# EasyEDA Pro project ProDoc_OHPP_003A_MIDI_B.epro, schematic OHPP-003A-MIDI_B_2

## Sheets
1 POWER BLOCK DIAGRAM: Board Name: OHPP-003A MIDI-B; Create Date: 2025-08-11; Page Name: POWER BLOCK DIAGRAM; Project Name: OHPP-003A-MIDI Cable Replacement; Schematic Name: OHPP-003A-MIDI_B; Update Date: 2025-09-15; Company: Silicon Labs; Page Size: A3; Version: V1.0
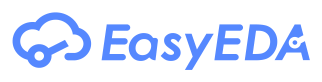
[diagram p0: POWER BLOCK DIAGRAM]
2 MIDI: Board Name: OHPP-003A MIDI-B_2; Create Date: 2025-11-18; Page Name: MIDI; Schematic Name: OHPP-003A-MIDI_B_2; Update Date: 2025-11-18
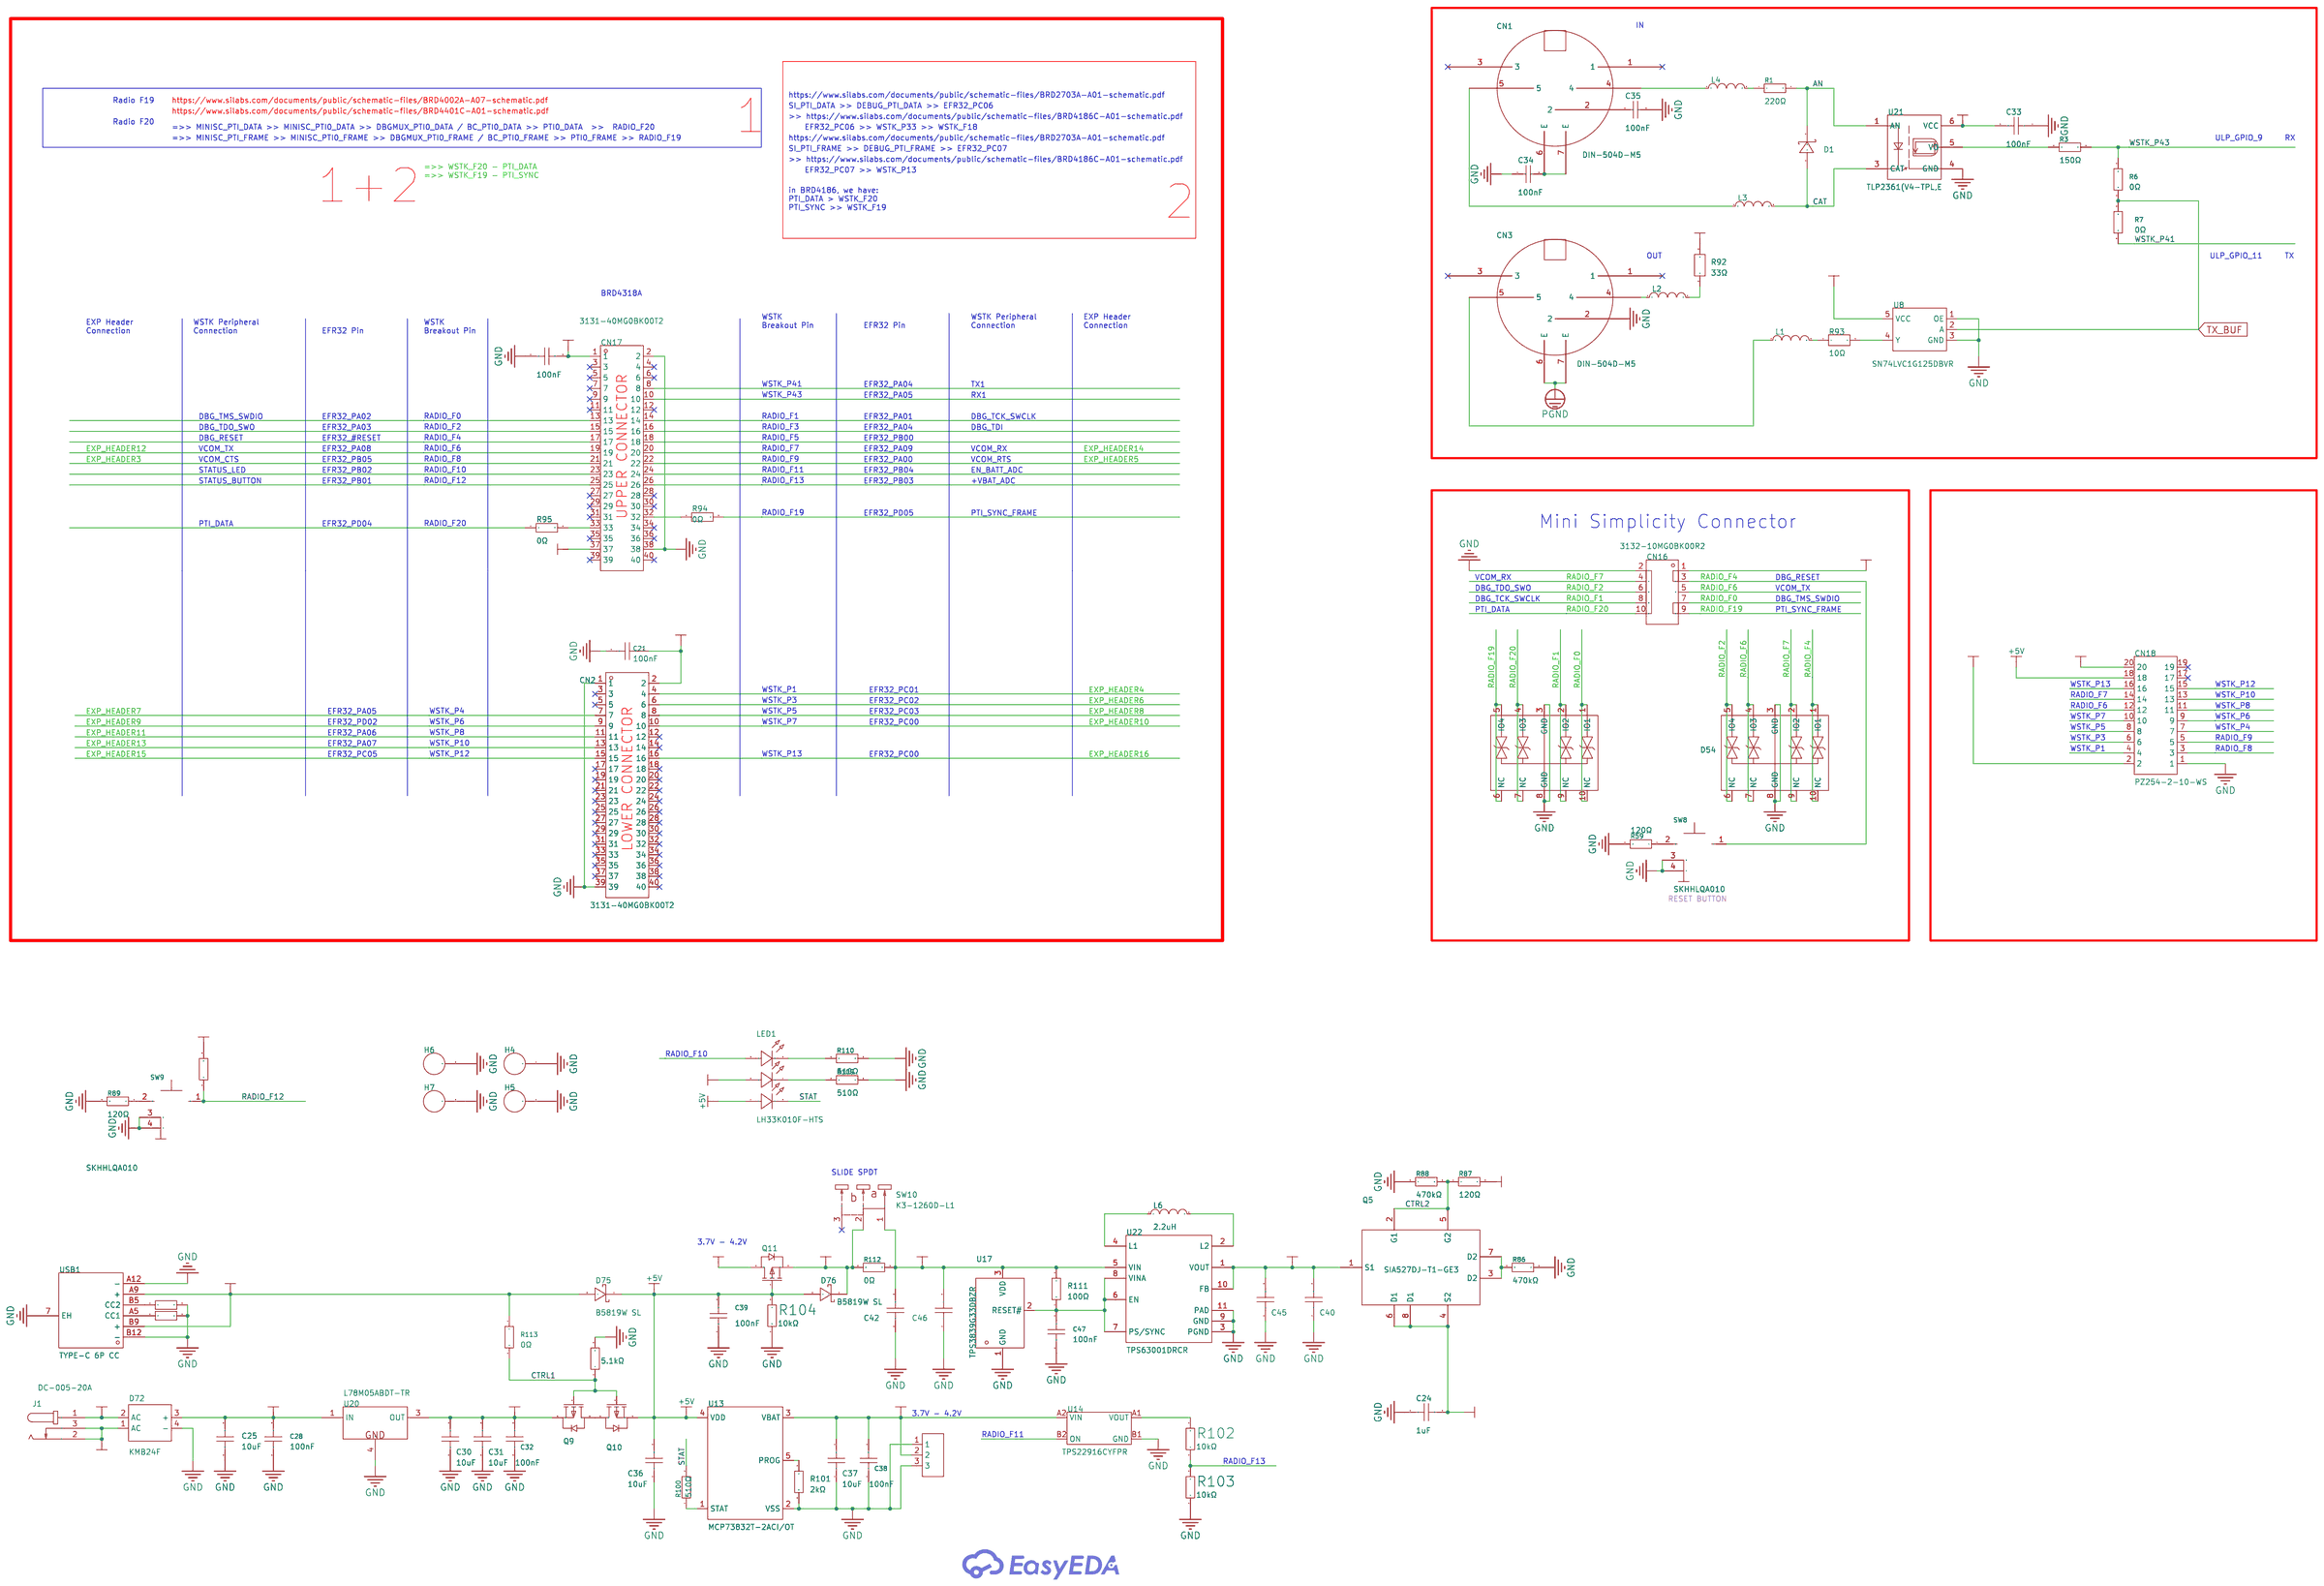
[diagram p1: MIDI]

## Parts
C20  100nF  [C0603]
C21  100nF  [C0603]
C24  1uF  [C0603]
C25  10uF  [C0603]
C28  100nF  [C0603]
C30  10uF  [C0603]
C31  10uF  [C0603]
C32  100nF  [C0603]
C33  100nF  [C0603]
C34  100nF  [C0805]
C35  100nF  [C0805]
C36  10uF  [C0603]
C37  10uF  [C0603]
C38  100nF  [C0603]
C39  100nF  [C0603]
C40  10uF  [C0603]
C42  10uF  [C0603]
C45  10uF  [C0603]
C46  10uF  [C0603]
C47  100nF  [C0603]
CN1  DIN-504D-M5  [CONN-TH_DIN-504D-M5]
CN2  3131-40MG0BK00T2  [CONN-SMD_40P-P1.27_WCON_3131-40MG0BK00T2]
CN3  DIN-504D-M5  [CONN-TH_DIN-504D-M5]
CN16  3132-10MG0BK00R2  [IDC-SMD_3132-10MG0BK00R2]
CN17  3131-40MG0BK00T2  [CONN-SMD_40P-P1.27_WCON_3131-40MG0BK00T2]
CN18  PZ254-2-10-WS  [HDR-SMD_20P-P2.54-H-M-R2-C10_L8.5]
D1  MBRA140T3G  [SMA_L4.3-W2.6-LS5.2-RD]
D54  TPD4E02B04DQAR  [USON-10_L2.5-W1.0-P0.50-BL]
D69  TPD4E02B04DQAR  [USON-10_L2.5-W1.0-P0.50-BL]
D72  KMB24F  [DIO-BG-SMD_MBF-TL]
D75  B5819W SL  [SOD-123_L2.7-W1.6-LS3.7-RD-1]
D76  B5819W SL  [SOD-123_L2.7-W1.6-LS3.7-RD-1]
H4  -  [HOLE_D3M5_D7M0_PAD_PTH]  (no BOM)
H5  -  [HOLE_D3M5_D7M0_PAD_PTH]  (no BOM)
H6  -  [HOLE_D3M5_D7M0_PAD_PTH]  (no BOM)
H7  -  [HOLE_D3M5_D7M0_PAD_PTH]  (no BOM)
H8  KH-2.54PH180-1X3P-L11.5  [HDR-TH_3P-P2.54-V-M]
J1  DC-005-20A  [DC-IN-TH_DC-005-20A]
L1  MMZ1608Y102BTD25  [L0603]
L2  MMZ1608Y102BTD25  [L0603]
L3  MMZ1608Y102BTD25  [L0603]
L4  MMZ1608Y102BTD25  [L0603]
L6  2.2uH  [L0806]
LED1  LH33K010F-HTS  [LED-TH_6P-L11.6-W4.4-P2.54_LH33K010F-HTS]
Q5  SIA527DJ-T1-GE3  [POWERPAK-SC-70-6_L2.0-W2.0-P0.65-BL]
Q9  SI2301CDS-T1-GE3  [SOT-23-3_L3.0-W1.7-P0.95-LS2.9-BR]
Q10  SI2301CDS-T1-GE3  [SOT-23-3_L3.0-W1.7-P0.95-LS2.9-BR]
Q11  SI2301CDS-T1-GE3  [SOT-23-3_L3.0-W1.7-P0.95-LS2.9-BR]
R1  220Ω  [R0603]
R3  150Ω  [R0603]
R6  0Ω  [R0402]  (no BOM)
R7  0Ω  [R0402]
R59  120Ω  [R0603]
R86  470kΩ  [R0603]  (no BOM)
R87  120Ω  [R0603]
R88  470kΩ  [R0603]
R89  120Ω  [R0603]
R91  10kΩ  [R0603]
R92  33Ω  [R0805]
R93  10Ω  [R0805]
R94  0Ω  [R0603]
R95  0Ω  [R0603]
R96  5.1kΩ  [R0603]
R97  5.1kΩ  [R0603]
R98  5.1kΩ  [R0603]
R100  510Ω  [R0603]
R101  2kΩ  [R0603]
R102  10kΩ  [R0603]
R103  10kΩ  [R0603]
R104  10kΩ  [R0603]
R109  510Ω  [R0603]
R110  510Ω  [R0603]
R111  100Ω  [R0603]
R112  0Ω  [R0402]  (no BOM)
R113  0Ω  [R0402]
SW8  SKHHLQA010  [KEY-TH_4P-SKHHLQA010]
SW9  SKHHLQA010  [KEY-TH_4P-SKHHLQA010]
SW10  K3-1260D-L1  [SW-TH_K3-1260D-L1]
U8  SN74LVC1G125DBVR  [SOT-23-5_L3.0-W1.7-P0.95-LS2.8-BL]
U13  MCP73832T-2ACI/OT  [SOT-23-5_L3.0-W1.7-P0.95-LS2.8-BR]
U14  TPS22916CYFPR  [DSBGA-4_L0.8-W0.8-R2-C2-P0.40-BL]
U17  TPS3839G33DBZR  [SOT-23-3_L2.9-W1.3-P1.90-LS2.4-BR]  (no BOM)
U20  L78M05ABDT-TR  [TO-252-2_L6.5-W6.1-P4.58-LS10.0-TL]
U21  TLP2361(V4-TPL,E  [OPTO-SMD-5_L3.7-W4.6-P1.27-LS7.0-BR]
U22  TPS63001DRCR  [VSON-10_L3.0-W3.0-P0.50-TL-EP_TPS62410DRCR]
USB1  TYPE-C 6P CC  [TYPE-C-TH_SHOUHAN_TYPE-C-6P-CC]

## Library data of the parts
C20 C21 C28 C32 C33 C38 C39 C47 = CC0603KRX7R9BB104: Capacitance: Tolerance:±10% Tolerance:±10% Voltage Rated: Temperature Coefficient:; LCSC Part Name: 100nF ±10% 50V; Supplier Part: C14663; Manufacturer: YAGEO(国巨); Supplier Footprint: 0603; JLCPCB Part Class: Basic Part; Datasheet: https://atta.szlcsc.com/upload/public/pdf/source/20180910/C282072_33301C7F631E79921B82A8DAC6BCC5B3.pdf; Supplier: LCSC; Tolerance: ±10%
C24 = CL10A105KB8NNNC: Capacitance: Tolerance:±10% Tolerance:±10% Voltage Rated: Temperature Coefficient:; LCSC Part Name: 1uF ±10% 50V; Supplier Part: C15849; Manufacturer: SAMSUNG(三星); Supplier Footprint: 0603; JLCPCB Part Class: Basic Part; Datasheet: https://atta.szlcsc.com/upload/public/pdf/source/20160218/1457707763339.pdf; Supplier: LCSC; Tolerance: ±10%
C25 C30 C31 C36 C37 C40 C42 C45 C46 = CL10A106MA8NRNC: Capacitance:10uF Tolerance:±20% Tolerance:±20% Voltage Rating:25V Temperature Coefficient:X5R; LCSC Part Name: 10uF ±20% 25V; Supplier Part: C96446; Manufacturer: SAMSUNG(三星); Supplier Footprint: 0603; JLCPCB Part Class: Basic Part; Datasheet: https://item.szlcsc.com/datasheet/CL10A106MA8NRNC/97651.html; Supplier: LCSC; Tolerance: ±20%; Voltage Rating: 25V; Temperature Coefficient: X5R
C34 C35 = CL21B104KCFNNNE: Capacitance: Tolerance:±10% Tolerance:±10% Voltage Rated: Temperature Coefficient:; LCSC Part Name: 100nF ±10% 100V; Supplier Part: C28233; Manufacturer: SAMSUNG(三星); Supplier Footprint: 0805; JLCPCB Part Class: Basic Part; Datasheet: https://atta.szlcsc.com/upload/public/pdf/source/20160218/1457707763339.pdf; Supplier: LCSC; Tolerance: ±10%
CN1 CN3 = DIN-504D-M5-CP-V1.0.0: Supplier Part: C2939347; Manufacturer: HOOYA(皓宇电子); Supplier Footprint: 插件; Datasheet: https://atta.szlcsc.com/upload/public/pdf/source/20220120/532EF17F4E31596A224288A7E1F8E76D.pdf; Supplier: LCSC
CN2 = 3131-40MG0BK00T2: Connector Type:Simple cow constellation Pitch:1.27mm Number of Positions or Pins:2x20P Current Rating:1A Voltage Rating (Max):- Holder Type:Standing paste Row Spacing:1.27mm Number of Rows:2 Number of PINs Per Row:20 Operating Temperature:-40℃~+105℃ Opera; LCSC Part Name: 1.27mm 2x20P 排数:2 每排P数:20; Supplier Part: C976753; Manufacturer: Wcon(维峰电子); Supplier Footprint: SMD,P=1.27mm; JLCPCB Part Class: Extended Part; Datasheet: https://atta.szlcsc.com/upload/public/pdf/source/20211202/B702BBAB0AED51B28E1877A6EDDD5ECD.pdf; Supplier: LCSC; Connector Type: Simple cow constellation; Pitch: 1.27mm; Number of Positions or Pins: 2x20P; Current Rating: 1A; Holder Type: Standing paste; Row Spacing: 1.27mm; Number of Rows: 2; Number of PINs Per Row: 20; Operating Temperature: -40℃~+105℃
CN16 = 3132-10MG0BK00R2: Connector Type:简牛座 Pitch:1.27mm Structure:2x5P Holder Type:Brick nogging Row Spacing:1.27mm Number of Rows:2 Pin Number in each Row:5 Contact Material:Brass Contact Plating:Gold; Supplier: LCSC; Supplier Part: C783843; Manufacturer: Wcon(维峰电子); LCSC Part Name: 1.27mm 2x5P 排数:2 每排P数:5; Supplier Footprint: SMD,P=1.27mm; Datasheet: https://atta.szlcsc.com/upload/public/pdf/source/20200914/C783843_74B4F3B0F5055CA38342214C72674E3E.pdf; Connector Type: 简牛座; Pitch: 1.27mm; Structure: 2x5P; Holder Type: Brick nogging; Row Spacing: 1.27mm; Number of Rows: 2; Pin Number in each Row: 5; Contact Material: Brass; Contact Plating: Gold
CN17 = 3131-40MG0BK00T2-UP-CP-V1.0.0: Connector Type:Simple cow constellation Pitch:1.27mm Number of Positions or Pins:2x20P Current Rating:1A Voltage Rating (Max):- Holder Type:Standing paste Row Spacing:1.27mm Number of Rows:2 Number of PINs Per Row:20 Operating Temperature:-40℃~+105℃ Opera; LCSC Part Name: 1.27mm 2x20P 排数:2 每排P数:20; Supplier Part: C976753; Manufacturer: Wcon(维峰电子); Supplier Footprint: SMD,P=1.27mm; Datasheet: https://atta.szlcsc.com/upload/public/pdf/source/20211202/B702BBAB0AED51B28E1877A6EDDD5ECD.pdf; Supplier: LCSC; Connector Type: Simple cow constellation; Pitch: 1.27mm; Number of Positions or Pins: 2x20P; Current Rating: 1A; Holder Type: Standing paste; Row Spacing: 1.27mm; Number of Rows: 2; Number of PINs Per Row: 20; Operating Temperature: -40℃~+105℃
CN18 = PZ254-2-10-WS: Pin Structure:2x10P Pitch:2.54mm Row Spacing:2.54mm Circluar Pins/Square Pins:Pin Header Mounting Type:Surface Mount, Right Angle Number of Rows:2 Number of Pins:20P Current Rating:3A Voltage Rating (Max):- Length of Mating Pin:6mm Insulation Height:2.5mm; LCSC Part Name: 黑色 2x10P 间距:2.54mm 方针 卧贴; Supplier Part: C5149360; Manufacturer: HCTL(华灿天禄); Supplier Footprint: SMD,P=2.54mm,卧贴; JLCPCB Part Class: Extended Part; Datasheet: https://item.szlcsc.com/datasheet/PZ254-2-10-WS/5773836.html; Supplier: LCSC; Pin Structure: 2x10P; Pitch: 2.54mm; Row Spacing: 2.54mm; Circluar Pins/Square Pins: Pin Header; Mounting Type: Surface Mount, Right Angle; Number of Rows: 2; Number of Pins: 20P; Current Rating: 3A; Length of Mating Pin: 6mm; Insulation Height: 2.5mm; Operating Temperature: -40℃~+105℃; Color: Black
D1 = MBRA140T3G: Forward Voltage (Vf@If):550mV@1A Reverse Voltage (Vr):40V Rectified Current:1A Reverse Leakage Current (Ir):500uA@40V; LCSC Part Name: 电压:40V 电流:1A; Supplier Part: C54798; Manufacturer: onsemi(安森美); Supplier Footprint: SMA(DO-214AC); JLCPCB Part Class: Extended Part; Datasheet: https://atta.szlcsc.com/upload/public/pdf/source/20170919/C54798_1505787325863977110.PDF; Supplier: LCSC; Forward Voltage (Vf@If): 550mV@1A; Reverse Voltage (Vr): 40V; Rectified Current: 1A; Reverse Leakage Current (Ir): 500uA@40V
D54 D69 = TPD4E02B04DQAR: polarity:Bi-Directional Reverse Stand-Off Voltage (Vrwm):3.6V Maximum Clamping Voltage:8.8V Peak Pulse Current (Ipp)@10/1000us:5A Peak Pulse Power Dissipation (Ppp)@10/1000us:17W Breakdown Voltage:5.5V Operating Temperature:-40℃~+125℃@(Ta) Operating Tempe; LCSC Part Name: 双向ESD; Supplier Part: C106794; Manufacturer: TI(德州仪器); Supplier Footprint: USON-10(1x2.5); JLCPCB Part Class: Extended Part; Datasheet: https://www.ti.com/cn/lit/gpn/tpd4e02b04; Supplier: LCSC; polarity: Bi-Directional; Reverse Stand-Off Voltage (Vrwm): 3.6V; Maximum Clamping Voltage: 8.8V; Peak Pulse Current (Ipp)@10/1000us: 5A; Peak Pulse Power Dissipation (Ppp)@10/1000us: 17W; Breakdown Voltage: 5.5V; Operating Temperature: -40℃~+125℃@(Ta); Type: ESD
D72 = KMB24F-CP-V1.0.0: Voltage - Forward(Vf@If):550mV@2A Voltage - DC Reverse(Vr):40V Current - Rectified: Reverse Leakage Current (Ir):500uA@40V Peak Forward Surge Current: Operating Temperature:-55℃~+125℃@(Tj) Operating Temperature:-55℃~+125℃@(Tj); Supplier Part: C113927; Manufacturer: MDD(辰达半导体); Supplier Footprint: MBF; Datasheet: https://atta.szlcsc.com/upload/public/pdf/source/20240710/05C92F5BBCD34B195B4F5956553F919E.pdf; Supplier: LCSC; Voltage - Forward(Vf@If): 550mV@2A; Voltage - DC Reverse(Vr): 40V; Reverse Leakage Current (Ir): 500uA@40V; Operating Temperature: -55℃~+125℃@(Tj)
D75 D76 = B5819W SL: Voltage - Forward(Vf@If):600mV@1A Voltage - DC Reverse(Vr):40V Current - Rectified:1A Non-Repetitive Peak Forward Surge Current:9A; LCSC Part Name: 电压:40V 电流:1A; Supplier Part: C8598; Manufacturer: CJ(江苏长电/长晶); Supplier Footprint: SOD-123; JLCPCB Part Class: Basic Part; Datasheet: https://item.szlcsc.com/datasheet/B5819W%2520SL/9093.html; Supplier: LCSC; Voltage - Forward(Vf@If): 600mV@1A; Voltage - DC Reverse(Vr): 40V; Current - Rectified: 1A; Non-Repetitive Peak Forward Surge Current: 9A
H4-H7 = HOLE_D3M5_D7M0_PAD_PTH: 3.5mm diameter plated M3 clearance hole with 7mm diameter pad around it to clear nuts and washers. The symbol has a pin to connect this pad to a net if required. Place a Not Connected &apos;X&apos; on the pin if the hole is to be isolated.
H8 = KH-2.54PH180-1X3P-L11.5: Pin Structure:1x3P Pitch:2.54mm Row Spacing:- Circluar Pins/Square Pins:Pin Header Mounting Type:Through Hole Number of Rows:1 Number of Pins:3P Current Rating:3A Voltage Rating (Max):- Length of Mating Pin:6mm Insulation Height:2.5mm Length of End Connec; LCSC Part Name: 1x3P 间距:2.54mm 方针 直插; Supplier Part: C2932698; Manufacturer: kinghelm(金航标); Supplier Footprint: 插件,P=2.54mm; JLCPCB Part Class: Extended Part; Datasheet: https://item.szlcsc.com/datasheet/KH-2.54PH180-1X3P-L11.5/3278219.html; Supplier: LCSC; Pin Structure: 1x3P; Pitch: 2.54mm; Circluar Pins/Square Pins: Pin Header; Mounting Type: Through Hole; Number of Rows: 1; Number of Pins: 3P; Current Rating: 3A; Length of Mating Pin: 6mm; Insulation Height: 2.5mm; Length of End Connection Pin: 3mm; Operating Temperature: -40℃~+105℃; Color: Black
J1 = DC-005-20A_C136744: Connector Type:DC Power Receptacle Mounting Style:Bend insert Inside Contact Diameter:2mm Outside Contact Diameter:6.4mm Current Rating (Max):500mA Voltage Rating (Max):30V Operating Temperature Range:-25℃~+80℃ Operating Temperature Range:-25℃~+80℃; LCSC Part Name: DC电源插座 内径:2mm 外径:6.4mm; Supplier Part: C136744; Manufacturer: 韩国韩荣; Supplier Footprint: 插件; JLCPCB Part Class: Extended Part; Datasheet: https://atta.szlcsc.com/upload/public/pdf/source/20210810/D1FE451D887B1804F0660F580C4AD849.pdf; Supplier: LCSC; Connector Type: DC Power Receptacle; Mounting Style: Bend insert; Inside Contact Diameter: 2mm; Outside Contact Diameter: 6.4mm; Current Rating (Max): 500mA; Voltage Rating (Max): 30V; Operating Temperature Range: -25℃~+80℃
L1-L4 = MMZ1608Y102BTD25: Impedance @ Frequency:1kΩ@100MHz Tolerance:±25% Tolerance:±25% DC Resistance:500mΩ Current Rating:400mA Circuits:1; LCSC Part Name: 单路 0603磁珠 阻抗1kΩ@100MHz; Supplier Part: C531293; Manufacturer: TDK; Supplier Footprint: 0603; JLCPCB Part Class: Extended Part; Datasheet: https://atta.szlcsc.com/upload/public/pdf/source/20191009/C434821_983145D9F97A39953D54E714C56E38F6.pdf; Supplier: LCSC; Impedance @ Frequency: 1kΩ@100MHz; Tolerance: ±25%; DC Resistance: 500mΩ; Current Rating: 400mA; Circuits: 1
L6 = TFM201610GHM-2R2MTAA: Inductance: Tolerance:±20% Tolerance:±20% Rated Current: DC Resistance (DCR):; LCSC Part Name: 2.2uH ±20%; Supplier Part: C136243; Manufacturer: TDK; Supplier Footprint: 0806; JLCPCB Part Class: Extended Part; Datasheet: https://atta.szlcsc.com/upload/public/pdf/source/20171102/C136243_15096092932071078408.pdf; Supplier: LCSC; Tolerance: ±20%
LED1 = LH33K010F-HTS: Lamp Holder Type:-; LCSC Part Name: 带LHY3303-4灯座的3.0mmLED灯; Supplier Part: C5252438; Manufacturer: PARALIGHT(光鼎); Supplier Footprint: DIP-6-2.54mm; JLCPCB Part Class: Extended Part; Datasheet: https://item.szlcsc.com/datasheet/LH33K010F-HTS/5969797.html; Supplier: LCSC
Q5 = SIA527DJ-T1-GE3-CP-V1.0.0: Type:1 N-Channel + 1 P-Channel Drain Source Voltage (Vdss): Continuous Drain Current (Id): Drain Source On Resistance (RDS(on)@Vgs,Id):0.041Ω@4.5V,4.5A Power Dissipation (Pd): Gate Threshold Voltage (Vgs(th)@Id):400mV@250uA Total Gate Charge (Qg@Vgs):10.5; LCSC Part Name: 1个N沟道+1个P沟道 耐压:12V 电流:4.5A; Supplier Part: C222486; Manufacturer: VISHAY(威世); Supplier Footprint: PowerPAK-SC-70-6; Datasheet: https://atta.szlcsc.com/upload/public/pdf/source/20180518/C222486_7B4636894C9CF71AB66FFADFF3F49BDD.pdf; Supplier: LCSC; Type: 1 N-Channel + 1 P-Channel; Drain Source On Resistance (RDS(on)@Vgs,Id): 0.041Ω@4.5V,4.5A; Gate Threshold Voltage (Vgs(th)@Id): 400mV@250uA; Total Gate Charge (Qg@Vgs): 10.5nC@4.5V; Input Capacitance (Ciss@Vds): 1500pF@6V; Reverse Transfer Capacitance (Crss@Vds): 250pF@6V; Operating Temperature: -55℃~+150℃
Q9-Q11 = SI2301CDS-T1-GE3: Number:1 P-Channel Drain to Source Voltage:20V Current - Continuous Drain(Id):3.1A RDS(on):142mΩ@2.5V,2.7A Pd - Power Dissipation:1.6W Gate Threshold Voltage (Vgs(th)):1V@250uA Gate Charge(Qg):10nC@4.5V Input Capacitance(Ciss):405pF Reverse Transfer Capac; LCSC Part Name: 1个P沟道 耐压:20V 电流:2.3A; Supplier Part: C10487; Manufacturer: VISHAY(威世); Supplier Footprint: SOT-23; JLCPCB Part Class: Basic Part; Datasheet: https://item.szlcsc.com/datasheet/SI2301CDS-T1-GE3/11030.html; Supplier: LCSC; Number: 1 P-Channel; Drain to Source Voltage: 20V; Current - Continuous Drain(Id): 3.1A; RDS(on): 142mΩ@2.5V,2.7A; Pd - Power Dissipation: 1.6W; Gate Threshold Voltage (Vgs(th)): 1V@250uA; Gate Charge(Qg): 10nC@4.5V; Input Capacitance(Ciss): 405pF; Reverse Transfer Capacitance (Crss@Vds): 55pF; Operating Temperature: -55℃~+150℃; Type: P-Channel; Output Capacitance(Coss): 75pF
R1 = 0603WAF2200T5E: Type:Thick Film Resistors Resistance: Tolerance:±1% Tolerance:±1% Power(Watts): Overload Voltage (Max): Temperature Coefficient:±100ppm/℃ Temperature Coefficient:±100ppm/℃ Operating Temperature Range:-55℃~+155℃ Operating Temperature Range:-55℃~+155℃; LCSC Part Name: 220Ω ±1% 100mW 厚膜电阻; Supplier Part: C22962; Manufacturer: UNI-ROYAL(厚声); Supplier Footprint: 0603; JLCPCB Part Class: Basic Part; Datasheet: https://atta.szlcsc.com/upload/public/pdf/source/20200306/C422600_1E6D84923E4A46A82E41ADD87F860B5C.pdf; Supplier: LCSC; Type: Thick Film Resistors; Tolerance: ±1%; Temperature Coefficient: ±100ppm/℃; Operating Temperature Range: -55℃~+155℃
R3 = 0603WAF1500T5E: Type:Thick Film Resistors Resistance: Tolerance:±1% Tolerance:±1% Power(Watts): Overload Voltage (Max): Temperature Coefficient:±100ppm/℃ Temperature Coefficient:±100ppm/℃ Operating Temperature Range:-55℃~+155℃ Operating Temperature Range:-55℃~+155℃; LCSC Part Name: 150Ω ±1% 100mW 厚膜电阻; Supplier Part: C22808; Manufacturer: UNI-ROYAL(厚声); Supplier Footprint: 0603; JLCPCB Part Class: Basic Part; Datasheet: https://atta.szlcsc.com/upload/public/pdf/source/20200306/C422600_1E6D84923E4A46A82E41ADD87F860B5C.pdf; Supplier: LCSC; Type: Thick Film Resistors; Tolerance: ±1%; Temperature Coefficient: ±100ppm/℃; Operating Temperature Range: -55℃~+155℃
R6 R7 R112 R113 = 0402WGF0000TCE: Type:Thick Film Resistors Resistance: Tolerance:±1% Tolerance:±1% Power(Watts): Overload Voltage (Max): Temperature Coefficient:±800ppm/℃ Temperature Coefficient:±800ppm/℃ Operating Temperature Range:-55℃~+155℃ Operating Temperature Range:-55℃~+155℃; LCSC Part Name: 0Ω ±1% 62.5mW 厚膜电阻; Supplier Part: C17168; Manufacturer: UNI-ROYAL(厚声); Supplier Footprint: 0402; JLCPCB Part Class: Basic Part; Datasheet: https://atta.szlcsc.com/upload/public/pdf/source/20200306/C422600_1E6D84923E4A46A82E41ADD87F860B5C.pdf; Supplier: LCSC; Type: Thick Film Resistors; Tolerance: ±1%; Temperature Coefficient: ±800ppm/℃; Operating Temperature Range: -55℃~+155℃
R59 R87 R89 = 0603WAF1200T5E: Type:Thick Film Resistors Resistance: Tolerance:±1% Tolerance:±1% Power(Watts): Overload Voltage (Max): Temperature Coefficient:±100ppm/℃ Temperature Coefficient:±100ppm/℃ Operating Temperature Range:-55℃~+155℃ Operating Temperature Range:-55℃~+155℃; LCSC Part Name: 120Ω ±1% 100mW 厚膜电阻; Supplier Part: C22787; Manufacturer: UNI-ROYAL(厚声); Supplier Footprint: 0603; JLCPCB Part Class: Basic Part; Datasheet: https://atta.szlcsc.com/upload/public/pdf/source/20200306/C422600_1E6D84923E4A46A82E41ADD87F860B5C.pdf; Supplier: LCSC; Type: Thick Film Resistors; Tolerance: ±1%; Temperature Coefficient: ±100ppm/℃; Operating Temperature Range: -55℃~+155℃
R86 R88 = 0603WAF4703T5E: Type:Thick Film Resistors Resistance:470kΩ Tolerance:±1% Tolerance:±1% Power(Watts): Overload Voltage (Max): Temperature Coefficient:±100ppm/℃ Temperature Coefficient:±100ppm/℃ Operating Temperature Range:-55℃~+155℃ Operating Temperature Range:-55℃~+155℃; LCSC Part Name: 470kΩ ±1% 100mW 厚膜电阻; Supplier Part: C23178; Manufacturer: UNI-ROYAL(厚声); Supplier Footprint: 0603; JLCPCB Part Class: Basic Part; Datasheet: https://atta.szlcsc.com/upload/public/pdf/source/20200306/C422600_1E6D84923E4A46A82E41ADD87F860B5C.pdf; Supplier: LCSC; Type: Thick Film Resistors; Tolerance: ±1%; Temperature Coefficient: ±100ppm/℃; Operating Temperature Range: -55℃~+155℃
R91 R102-R104 = 0603WAF1002T5E: Type:Thick Film Resistors Resistance:10kΩ Tolerance:±1% Tolerance:±1% Power(Watts): Overload Voltage (Max): Temperature Coefficient:±100ppm/℃ Temperature Coefficient:±100ppm/℃ Operating Temperature Range:-55℃~+155℃ Operating Temperature Range:-55℃~+155℃; LCSC Part Name: 厚膜电阻 10kΩ ±1% 100mW; Supplier Part: C25804; Manufacturer: UNI-ROYAL(厚声); Supplier Footprint: 0603; JLCPCB Part Class: Basic Part; Datasheet: https://atta.szlcsc.com/upload/public/pdf/source/20200306/C422600_1E6D84923E4A46A82E41ADD87F860B5C.pdf; Supplier: LCSC; Type: Thick Film Resistors; Tolerance: ±1%; Temperature Coefficient: ±100ppm/℃; Operating Temperature Range: -55℃~+155℃
R92 = AS05W2J0330T5E: Type:Thick Film Resistors Resistance:33Ω Tolerance:±5% Tolerance:±5% Power(Watts):0.5W Voltage-Supply(Max):150V Temperature Coefficient:±100ppm/℃ Temperature Coefficient:±100ppm/℃ Operating Temperature:-55℃~+155℃ Operating Temperature:-55℃~+155℃; LCSC Part Name: 33Ω ±5% 500mW 厚膜电阻; Supplier Part: C560522; Manufacturer: UNI-ROYAL(厚声); Supplier Footprint: 0805; JLCPCB Part Class: Extended Part; Datasheet: https://item.szlcsc.com/datasheet/AS05W2J0330T5E/584984.html; Supplier: LCSC; Type: Thick Film Resistors; Tolerance: ±5%; Power(Watts): 0.5W; Voltage-Supply(Max): 150V; Temperature Coefficient: ±100ppm/℃; Operating Temperature: -55℃~+155℃
R93 = AC0805FR-7W10RL: Type:Thick Film Resistors Resistance: Tolerance:±1% Tolerance:±1% Power(Watts):250mW Overload Voltage (Max): Temperature Coefficient:±200ppm/℃ Temperature Coefficient:±200ppm/℃ Operating Temperature Range:-55℃~+155℃ Operating Temperature Range:-55℃~+155℃; LCSC Part Name: 厚膜电阻 10Ω ±1% 250mW; Supplier Part: C727983; Manufacturer: YAGEO(国巨); Supplier Footprint: 0805; JLCPCB Part Class: Extended Part; Datasheet: https://atta.szlcsc.com/upload/public/pdf/source/20200821/C727952_41DBFD40DC9019BCD03635260E40DDDE.pdf; Supplier: LCSC; Type: Thick Film Resistors; Tolerance: ±1%; Power(Watts): 250mW; Temperature Coefficient: ±200ppm/℃; Operating Temperature Range: -55℃~+155℃
R94 R95 = 0603WAF0000T5E: Type:Thick Film Resistors Resistance: Tolerance:±1% Tolerance:±1% Power(Watts): Overload Voltage (Max): Operating Temperature Range:-55℃~+155℃ Operating Temperature Range:-55℃~+155℃; LCSC Part Name: 0Ω ±1% 100mW 厚膜电阻; Supplier Part: C21189; Manufacturer: UNI-ROYAL(厚声); Supplier Footprint: 0603; JLCPCB Part Class: Basic Part; Datasheet: https://atta.szlcsc.com/upload/public/pdf/source/20200306/C422600_1E6D84923E4A46A82E41ADD87F860B5C.pdf; Supplier: LCSC; Type: Thick Film Resistors; Tolerance: ±1%; Operating Temperature Range: -55℃~+155℃
R96-R98 = 0603WAF5101T5E: Type:Thick Film Resistor Resistance:5.1kΩ Tolerance:±1% Tolerance:±1% Power(Watts):100mW Voltage-Supply(Max):75V Temperature Coefficient:±100ppm/℃ Temperature Coefficient:±100ppm/℃ Operating Temperature:-55℃~+155℃ Operating Temperature:-55℃~+155℃; LCSC Part Name: 5.1kΩ ±1% 100mW 厚膜电阻; Supplier Part: C23186; Manufacturer: UNI-ROYAL(厚声); Supplier Footprint: 0603; JLCPCB Part Class: Basic Part; Datasheet: https://item.szlcsc.com/datasheet/0603WAF5101T5E/23913.html; Supplier: LCSC; Type: Thick Film Resistor; Tolerance: ±1%; Power(Watts): 100mW; Voltage-Supply(Max): 75V; Temperature Coefficient: ±100ppm/℃; Operating Temperature: -55℃~+155℃
R100 R109 R110 = 0603WAF5100T5E: Type:Thick Film Resistors Resistance: Tolerance:±1% Tolerance:±1% Power(Watts): Overload Voltage (Max): Temperature Coefficient:±100ppm/℃ Temperature Coefficient:±100ppm/℃ Operating Temperature Range:-55℃~+155℃ Operating Temperature Range:-55℃~+155℃; LCSC Part Name: 510Ω ±1% 100mW 厚膜电阻; Supplier Part: C23193; Manufacturer: UNI-ROYAL(厚声); Supplier Footprint: 0603; JLCPCB Part Class: Basic Part; Datasheet: https://atta.szlcsc.com/upload/public/pdf/source/20200306/C422600_1E6D84923E4A46A82E41ADD87F860B5C.pdf; Supplier: LCSC; Type: Thick Film Resistors; Tolerance: ±1%; Temperature Coefficient: ±100ppm/℃; Operating Temperature Range: -55℃~+155℃
R101 = 0603WAF2001T5E: Type:Thick Film Resistor Resistance:2kΩ Tolerance:±1% Tolerance:±1% Power(Watts):100mW Voltage-Supply(Max):75V Temperature Coefficient:±100ppm/℃ Temperature Coefficient:±100ppm/℃ Operating Temperature:-55℃~+155℃ Operating Temperature:-55℃~+155℃; LCSC Part Name: 2kΩ ±1% 100mW 厚膜电阻; Supplier Part: C22975; Manufacturer: UNI-ROYAL(厚声); Supplier Footprint: 0603; JLCPCB Part Class: Basic Part; Datasheet: https://item.szlcsc.com/datasheet/0603WAF2001T5E/23702.html; Supplier: LCSC; Type: Thick Film Resistor; Tolerance: ±1%; Power(Watts): 100mW; Voltage-Supply(Max): 75V; Temperature Coefficient: ±100ppm/℃; Operating Temperature: -55℃~+155℃
R111 = 0603WAF1000T5E: Type:Thick Film Resistors Resistance: Tolerance:±1% Tolerance:±1% Power(Watts): Overload Voltage (Max): Temperature Coefficient:±200ppm/℃ Temperature Coefficient:±200ppm/℃ Operating Temperature Range:-55℃~+155℃ Operating Temperature Range:-55℃~+155℃; LCSC Part Name: 100Ω ±1% 100mW 厚膜电阻; Supplier Part: C22775; Manufacturer: UNI-ROYAL(厚声); Supplier Footprint: 0603; JLCPCB Part Class: Basic Part; Datasheet: https://atta.szlcsc.com/upload/public/pdf/source/20200306/C422600_1E6D84923E4A46A82E41ADD87F860B5C.pdf; Supplier: LCSC; Type: Thick Film Resistors; Tolerance: ±1%; Temperature Coefficient: ±200ppm/℃; Operating Temperature Range: -55℃~+155℃
SW8 SW9 = SKHHLQA010: Circuit:SPST Actuator Style:Round Button Mounting Type:Right Angle Length:6mm Width:6mm Switch Height:8.35mm Contact Current:50mA Voltage Rating:12V With Lamp:- Life:-; Supplier: LCSC; Manufacturer: ALPSALPINE(阿尔卑斯阿尔派); Supplier Part: C125034; JLCPCB Part Class: Extended Part; LCSC Part Name: 6*6*8.35mm 卧插 轻触开关; Supplier Footprint: 弯插-4P,6x6mm; Datasheet: https://item.szlcsc.com/datasheet/SKHHLQA010/136310.html; Circuit: SPST; Actuator Style: Round Button; Mounting Type: Right Angle; Length: 6mm; Width: 6mm; Switch Height: 8.35mm; Contact Current: 50mA; Voltage Rating: 12V
SW10 = K3-1260D-L1: Circuit:SPDT Actuator Style:Rectangular Columnar Termination Style:PC Pin Length:9mm Width:3.5mm Switch Height:3.5mm Mounting Type:- Actuator Color:Black Current Rating:300mA Voltage Rating:6V Life:10,000 Cycles Operating Temperature:-25℃~+80℃ Operating T; LCSC Part Name: 卧插双档 滑动开关; Supplier Part: C92657; Manufacturer: 韩国韩荣; Supplier Footprint: 插件,9x3.5mm; JLCPCB Part Class: Extended Part; Datasheet: https://item.szlcsc.com/datasheet/K3-1260D-L1/93850.html; Supplier: LCSC; Circuit: SPDT; Actuator Style: Rectangular Columnar; Termination Style: PC Pin; Length: 9mm; Width: 3.5mm; Switch Height: 3.5mm; Actuator Color: Black; Current Rating: 300mA; Voltage Rating: 6V; Life: 10,000 Cycles; Operating Temperature: -25℃~+80℃
U8 = SN74LVC1G125DBVR-CP-V1.0.0: output type:Tri-State Voltage - Supply:1.65V~5.5V Voltage - Supply:1.65V~5.5V Number of Elements:1 Number of Bits per Element:1 Current - Output Low(IOL):32mA Current - Output High(IOH):32mA Logic Family:74LVC Operating Temperature:-40℃~+125℃ Operating Te; Supplier Part: C23654; Manufacturer: TI(德州仪器); Supplier Footprint: SOT-23-5; Datasheet: https://www.ti.com/cn/lit/gpn/sn74lvc1g125; Supplier: LCSC; output type: Tri-State; Voltage - Supply: 1.65V~5.5V; Number of Elements: 1; Number of Bits per Element: 1; Current - Output Low(IOL): 32mA; Current - Output High(IOH): 32mA; Logic Family: 74LVC; Operating Temperature: -40℃~+125℃
U13 = MCP73832T-2ACI/OT_CP_V1.0.0: The Chip Type:- Voltage - Supply:3.75V~6V Voltage - Supply:3.75V~6V Charge Current - Max:- Charging Saturation Voltage:4.2V Type of Battery:Lithium-ion/Polymer Number of Cells:1 Number of Cells:1 Operating Temperature:-40℃~+85℃ Operating Temperature:-40℃~; Supplier Part: C38066; Manufacturer: MICROCHIP(美国微芯); Supplier Footprint: SOT-23-5; Datasheet: https://item.szlcsc.com/datasheet/MCP73832T-2ACI%252FOT/39047.html; Supplier: LCSC; Voltage - Supply: 3.75V~6V; Charging Saturation Voltage: 4.2V; Type of Battery: Lithium-ion/Polymer; Number of Cells: 1; Operating Temperature: -40℃~+85℃
U14 = TPS22916CYFPR: Type:Load Switch Number of Channels:1 Control Input Logic:Active High Voltage - Supply:1V~5.5V Voltage - Supply:1V~5.5V RDS(on):60mΩ Operating Temperature	-:-40℃~+85℃ Operating Temperature	-:-40℃~+85℃; Supplier Part: C2680319; Manufacturer: TI(德州仪器); Supplier Footprint: DSBGA-4(0.7x0.7); JLCPCB Part Class: Extended Part; Datasheet: https://www.ti.com/cn/lit/gpn/tps22916; Supplier: LCSC; Type: Load Switch; Number of Channels: 1; Control Input Logic: Active High; Voltage - Supply: 1V~5.5V; RDS(on): 60mΩ; Operating Temperature	-: -40℃~+85℃
U17 = TPS3839G33DBZR_CP_v1.0.0: ChipType:Voltage Monitor Output Type:Push-Pull Reset Active Level:Active Low Threshold Voltage:3.08V Number of Voltages Monitored:1 Manual Reset:No Watchdog:No Reset Timeout:200ms Operating Temperature:-40℃~+85℃@(TA) Operating Temperature:-40℃~+85℃@(TA); Supplier Part: C485802; Manufacturer: TI(德州仪器); Supplier Footprint: SOT-23-3; Datasheet: https://www.ti.com/cn/lit/gpn/tps3839; Supplier: LCSC; ChipType: Voltage Monitor; Output Type: Push-Pull; Reset Active Level: Active Low; Threshold Voltage: 3.08V; Number of Voltages Monitored: 1; Manual Reset: No; Watchdog: No; Reset Timeout: 200ms; Operating Temperature: -40℃~+85℃@(TA)
U20 = L78M05ABDT-TR: Output Type:Fixed Maximum Input Voltage:35V Output Voltage:5V Output Voltage:5V Output Current:500mA Power Supply Rejection Ratio (PSRR):62dB@(120Hz) Dropout Voltage:- standby current:6mA Feature:Short-Circuit  Protection；Thermal Protection(TSD)；Overcurre; LCSC Part Name: 精密500 mA稳压器; Supplier Part: C58069; Manufacturer: ST(意法半导体); Supplier Footprint: TO-252-2(DPAK); JLCPCB Part Class: Basic Part; Datasheet: https://atta.szlcsc.com/upload/public/pdf/source/20230728/311D30A65517FCBD6FE5D1CCA2CA8430.pdf; Supplier: LCSC; Output Type: Fixed; Maximum Input Voltage: 35V; Output Voltage: 5V; Output Current: 500mA; Power Supply Rejection Ratio (PSRR): 62dB@(120Hz); standby current: 6mA; Feature: Short-Circuit  Protection；Thermal Protection(TSD)；Overcurrent Protection(OCP); Operating Temperature: -40℃~+125℃; Output Polarity: Positive electrode; Number of Outputs: 1
U21 = TLP2361(V4-TPL,E: Input Type:DC Voltage - Supply:2.7V~5.5V Voltage - Supply:2.7V~5.5V Isolation Voltage(Vrms):3.75kV Data Rate:15Mbps Number of Channels:1 Operating Temperature:-40℃~+125℃ Operating Temperature:-40℃~+125℃; LCSC Part Name: DC输入 1通道 隔离电压(rms):3750V; Supplier Part: C123773; Manufacturer: TOSHIBA(东芝); Supplier Footprint: SOIC-5-4.6mm; JLCPCB Part Class: Extended Part; Datasheet: https://item.szlcsc.com/datasheet/TLP2361(V4-TPL%252CE/125045.html; Supplier: LCSC; Input Type: DC; Voltage - Supply: 2.7V~5.5V; Isolation Voltage(Vrms): 3.75kV; Data Rate: 15Mbps; Number of Channels: 1; Operating Temperature: -40℃~+125℃
U22 = TPS63001DRCR: Function:Boost type Output Type:Fixed Voltage - Supply:1.8V~5.5V Voltage - Supply:1.8V~5.5V Output Voltage:3.3V Output Voltage:3.3V Output Current:- Frequency - Switching:1.5MHz Frequency - Switching:1.5MHz Operating Temperature:-40℃~+85℃@(TA) Operating T; LCSC Part Name: 高效率单电感升降压转换器; Supplier Part: C28060; Manufacturer: TI(德州仪器); Supplier Footprint: VSON-10-EP(3x3); JLCPCB Part Class: Extended Part; Datasheet: https://www.ti.com/cn/lit/gpn/tps63001; Supplier: LCSC; Function: Boost type; Output Type: Fixed; Voltage - Supply: 1.8V~5.5V; Output Voltage: 3.3V; Frequency - Switching: 1.5MHz; Operating Temperature: -40℃~+85℃@(TA); Synchronous Rectifier: Yes; Number of Outputs: 1; Topology: Step-down-Boost; Switch tube (built-in/external): Built-in
USB1 = TYPE-C 6P CC: Connector Type:Type-C Protocol Standard:USB 3.1 Gender:Female Mounting Type:Vertical, Flag Number of Contacts:6P Number of Ports:1 Current Rating-Power:3A Voltage Rating:20V Connect-Disconnect Life:10,000 Cycles Detection color:Black Operating Temperature; LCSC Part Name: Type-C 母 侧插; Supplier Part: C5187473; Manufacturer: SHOU HAN(首韩); Supplier Footprint: 插件; JLCPCB Part Class: Extended Part; Datasheet: https://item.szlcsc.com/datasheet/TYPE-C%25206P%2520CC/5860368.html; Supplier: LCSC; Connector Type: Type-C; Protocol Standard: USB 3.1; Gender: Female; Mounting Type: Vertical, Flag; Number of Contacts: 6P; Number of Ports: 1; Current Rating-Power: 3A; Voltage Rating: 20V; Connect-Disconnect Life: 10,000 Cycles; Detection color: Black; Operating Temperature: -30℃~+85℃

## Nets
+3.3V_EFR: C20.2 C21.2 C24.2 C33.2 CN2.2 CN16.1 CN17.1 CN18.2 LED1.3(A) Q5.4(S2) Q5.6(D1) Q5.8(D1) R91.2 R92.2 U8.5(VCC) U21.6(VCC)
+3V3_BUCK_BOOST: C40.2 C45.2 CN18.20 Q5.1(S1) U22.1(VOUT) U22.10(FB)
+5V: C36.2 C39.2 CN17.37 CN18.18 D75.1(-) D76.2(+) LED1.1(A) Q10.2(S) Q11.1(G) R104.2 U13.4(VDD)
+5V_1: C30.2 C31.2 C32.2 Q9.2(S) U20.3(OUT)
+5V_2: D75.2(+) R113.1 USB1.A9(+) USB1.B9(+)
+8.3V: C25.2 C28.2 D72.3(+) U20.1(IN)
+9V: D72.2(AC) J1.1
+VBAT: C37.2 C38.2 H8.2 Q11.3(D) U13.3(VBAT) U14.A2(VIN)
+VCC: D76.1(-) Q11.2(S) R112.2 SW10.2
+VCC1: C42.2 C46.2 R87.2 R111.2 R112.1 SW10.1 U17.3(VDD) U22.5(VIN)
-9V: D72.1(AC) J1.2 J1.3
GND: C20.1 C21.1 C24.1 C25.1 C28.1 C30.1 C31.1 C32.1 C33.1 C34.1 C35.1 C36.1 C37.1 C38.1 C39.1 C40.1 C42.1 C45.1 C46.1 C47.2 CN2.1 CN2.39 CN3.2 CN16.2 CN17.2 CN17.38 CN18.1 D54.3(GND) D54.8(GND) D69.3(GND) D69.8(GND) D72.4(-) H4.1 H5.1 H6.1 H7.1 H8.1 H8.3 R59.2 R86.1 R88.1 R89.2 R96.2 R97.2 R98.2 R101.2 R103.1 R104.1 R109.1 R110.1 SW8.3 SW8.4 SW9.3 SW9.4 U8.1(OE) U8.3(GND) U13.2(VSS) U14.B1(GND) U17.1(GND) U20.4(GND) U21.4(GND) U22.3(PGND) U22.9(GND) U22.11(PAD) USB1.7(EH) USB1.A12(-) USB1.B12(-)
PGND: CN3.6(E) CN3.7(E)
AN: D1.1(C) R1.2 U21.1(AN)
CAT: D1.2(A) L3.2 U21.3(CAT)
CTRL1: Q9.1(G) Q10.1(G) R98.1 R113.2
CTRL2: Q5.2(G1) Q5.5(G2) R87.1 R88.2
RADIO_F0: CN16.7 CN17.13 D69.1(IO1) D69.10(NC)
RADIO_F1: CN16.8 CN17.14 D69.2(IO2) D69.9(NC)
RADIO_F2: CN16.6 CN17.15 D54.5(IO4) D54.6(NC)
RADIO_F3: CN17.16
RADIO_F4: CN16.3 CN17.17 D54.1(IO1) D54.10(NC) SW8.1
RADIO_F5: CN17.18
RADIO_F6: CN16.5 CN17.19 CN18.12 D54.4(IO3) D54.7(NC)
RADIO_F7: CN16.4 CN17.20 CN18.14 D54.2(IO2) D54.9(NC)
RADIO_F8: CN17.21 CN18.3
RADIO_F9: CN17.22 CN18.5
RADIO_F10: CN17.23 LED1.5(A)
RADIO_F11: CN17.24 U14.B2(ON)
RADIO_F12: CN17.25 R91.1 SW9.1
RADIO_F13: CN17.26 R102.1 R103.2
RADIO_F19: CN16.9 D69.5(IO4) D69.6(NC) R94.2
RADIO_F20: CN16.10 D69.4(IO3) D69.7(NC) R95.1
STAT: LED1.2(C) R100.2
TX_BUF: R6.2 R7.1 U8.2(A)
WSTK_P1: CN2.4 CN18.4
WSTK_P3: CN2.6 CN18.6
WSTK_P4: CN2.7 CN18.7
WSTK_P5: CN2.8 CN18.8
WSTK_P6: CN2.9 CN18.9
WSTK_P7: CN2.10 CN18.10
WSTK_P8: CN2.11 CN18.11
WSTK_P10: CN2.13 CN18.13
WSTK_P12: CN2.15 CN18.15
WSTK_P13: CN2.16 CN18.16
WSTK_P41: CN17.8 R7.2
WSTK_P43: CN17.10 R3.2 R6.1
$2N1273: R93.2 U8.4(Y)
$2N1277: CN3.5 L1.1
$2N4382: Q5.3(D2) Q5.7(D2) R86.2
$2N6105: R89.1 SW9.2
$2N12487: L1.2 R93.1
$2N12552: CN1.5 L3.1
$2N12590: L4.2 R1.1
$2N12593: CN1.4 L4.1
$2N15515: C34.2 CN1.6(E) CN1.7(E)
$2N15542: CN3.4 L2.1
$2N15546: L2.2 R92.1
$2N15633: C35.2 CN1.2
$2N30226: CN17.32 R94.1
$2N30268: CN17.33 R95.2
$2N74431: R97.1 USB1.A5(CC1)
$2N74433: R96.1 USB1.B5(CC2)
$2N74739: Q9.3(D) Q10.3(D)
$2N75619: R101.1 U13.5(PROG)
$2N75635: R100.1 U13.1(STAT)
$2N78282: R102.2 U14.A1(VOUT)
$2N80640: R59.1 SW8.2
$2N85855: LED1.6(C) R110.2
$2N85859: LED1.4(C) R109.2
$2N118115: R3.1 U21.5(VO)
$2N118330: L6.1 U22.4(L1)
$2N118335: L6.2 U22.2(L2)
$2N118624: C47.1 R111.1 U17.2(RESET#) U22.6(EN) U22.7(PS/SYNC) U22.8(VINA)

Not connected (* = marked no-connect by the designer): CN1 1* 3*; CN2 3* 5* 12* 14* 17* 18* 19* 20* 21* 22* 23* 24* 25* 26* 27* 28* 29* 30* 31* 32* 33* 34* 35* 36* 37* 38* 40*; CN3 1* 3*; CN17 3* 4* 5* 6* 7* 9* 11* 12* 27* 28* 29* 30* 31* 34* 35* 36* 39* 40*; CN18 17* 19*; SW10 3*

## Notes on the sheets
sheet 2
- IN
- https://www.silabs.com/documents/public/schematic-files/BRD2703A-A01-schematic.pdf
- Radio F19
- https://www.silabs.com/documents/public/schematic-files/BRD4002A-A07-schematic.pdf
- https://www.silabs.com/documents/public/schematic-files/BRD4401C-A01-schematic.pdf
- SI_PTI_DATA >> DEBUG_PTI_DATA >> EFR32_PC06
- Radio F20
- >> https://www.silabs.com/documents/public/schematic-files/BRD4186C-A01-schematic.pdf
- =>> MINISC_PTI_DATA >> MINISC_PTI0_DATA >> DBGMUX_PTI0_DATA / BC_PTI0_DATA >> PTI0_DATA  >>  RADIO_F20
- 1
- EFR32_PC06 >> WSTK_P33 >> WSTK_F18
- =>> MINISC_PTI_FRAME >> MINISC_PTI0_FRAME >> DBGMUX_PTI0_FRAME / BC_PTI0_FRAME >> PTI0_FRAME >> RADIO_F19
- SI_PTI_FRAME >> DEBUG_PTI_FRAME >> EFR32_PC07
- https://www.silabs.com/documents/public/schematic-files/BRD2703A-A01-schematic.pdf
- ULP_GPIO_9
- RX
- >> https://www.silabs.com/documents/public/schematic-files/BRD4186C-A01-schematic.pdf
- EFR32_PC07 >> WSTK_P13
- =>> WSTK_F20 - PTI_DATA
  =>> WSTK_F19 - PTI_SYNC
- 1+2
- in BRD4186, we have:
  PTI_DATA > WSTK_F20
  PTI_SYNC >> WSTK_F19
- 2
- OUT
- ULP_GPIO_11
- TX
- BRD4318A
- WSTK
  Breakout Pin
- EFR32 Pin
- WSTK Peripheral
  Connection
- EXP Header
  Connection
- EXP Header
  Connection
- WSTK Peripheral
  Connection
- EFR32 Pin
- WSTK
  Breakout Pin
- EFR32_PA04
- TX1
- EFR32_PA05
- RX1
- DBG_TDO_SWO
- DBG_TMS_SWDIO
- EFR32_PA02
- EFR32_PA03
- EFR32_PA01
- EFR32_PA04
- DBG_TCK_SWCLK
- DBG_TDI
- DBG_RESET
- EFR32_#RESET
- EFR32_PB00
- EXP_HEADER12
- VCOM_TX
- EFR32_PA08
- UPPER CONNECTOR
- EFR32_PA09
- VCOM_RX
- EXP_HEADER14
- EXP_HEADER3
- VCOM_CTS
- EFR32_PB05
- EFR32_PA00
- VCOM_RTS
- EXP_HEADER5
- STATUS_LED
- EFR32_PB02
- EFR32_PB04
- EN_BATT_ADC
- STATUS_BUTTON
- EFR32_PB01
- EFR32_PB03
- +VBAT_ADC
- EFR32_PD05
- PTI_SYNC_FRAME
- PTI_DATA
- EFR32_PD04
- Mini Simplicity Connector
- VCOM_RX
- DBG_RESET
- DBG_TDO_SWO
- VCOM_TX
- DBG_TCK_SWCLK
- DBG_TMS_SWDIO
- PTI_DATA
- PTI_SYNC_FRAME
- EFR32_PC01
- EXP_HEADER4
- EFR32_PC02
- EXP_HEADER6
- EXP_HEADER7
- EFR32_PA05
- EFR32_PC03
- EXP_HEADER8
- EXP_HEADER9
- EFR32_PD02
- EFR32_PC00
- EXP_HEADER10
- EXP_HEADER11
- EXP_HEADER13
- EFR32_PA06
- EFR32_PA07
- EXP_HEADER15
- EFR32_PC05
- EFR32_PC00
- EXP_HEADER16
- LOWER CONNECTOR
- RESET BUTTON
- SLIDE SPDT
- 3.7V - 4.2V
- 3.7V - 4.2V
